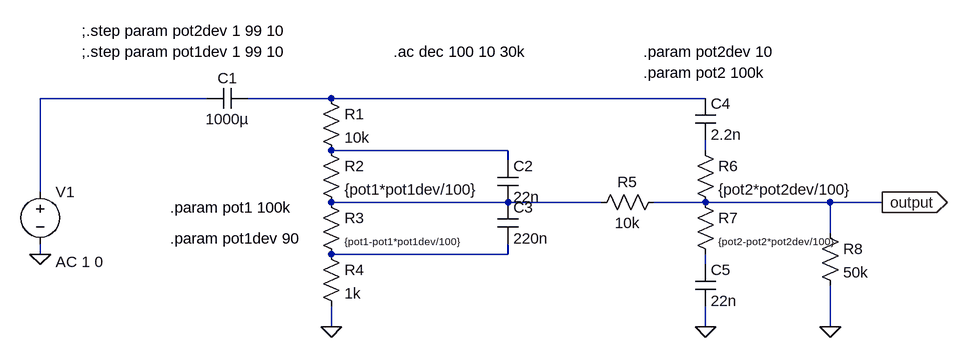
[diagram p0: schematic baxandal.asc]
baxandal.asc, the LTspice schematic file:
Version 4.1
SHEET 1 1448 680
WIRE 272 80 16 80
WIRE 464 80 336 80
WIRE 1040 80 464 80
WIRE 736 160 464 160
WIRE 1040 160 1040 144
WIRE 736 176 736 160
WIRE 16 224 16 80
WIRE 736 240 464 240
WIRE 880 240 736 240
WIRE 1040 240 960 240
WIRE 1232 240 1040 240
WIRE 1312 240 1232 240
WIRE 1232 288 1232 240
WIRE 16 320 16 304
WIRE 736 320 736 304
WIRE 736 320 464 320
WIRE 1040 336 1040 320
WIRE 464 432 464 400
WIRE 1040 432 1040 400
WIRE 1232 432 1232 368
FLAG 16 320 0
FLAG 1040 432 0
FLAG 1232 432 0
FLAG 1312 240 output
IOPIN 1312 240 Out
FLAG 464 432 0
SYMBOL voltage 16 208 R0
WINDOW 123 24 124 Left 2
WINDOW 39 0 0 Left 0
SYMATTR Value2 AC 1 0
SYMATTR InstName V1
SYMATTR Value ""
SYMBOL cap 336 64 R90
WINDOW 0 0 32 VBottom 2
WINDOW 3 32 32 VTop 2
SYMATTR InstName C1
SYMATTR Value 1000µ
SYMBOL res 448 64 R0
SYMATTR InstName R1
SYMATTR Value 10k
SYMBOL res 448 144 R0
SYMATTR InstName R2
SYMATTR Value {pot1*pot1dev/100}
SYMBOL res 448 224 R0
WINDOW 3 36 76 Left 1
SYMATTR Value {pot1-pot1*pot1dev/100}
SYMATTR InstName R3
SYMBOL res 448 304 R0
SYMATTR InstName R4
SYMATTR Value 1k
SYMBOL cap 720 176 R0
SYMATTR InstName C2
SYMATTR Value 22n
SYMBOL cap 720 240 R0
SYMATTR InstName C3
SYMATTR Value 220n
SYMBOL res 976 224 R90
WINDOW 0 0 56 VBottom 2
WINDOW 3 32 56 VTop 2
SYMATTR InstName R5
SYMATTR Value 10k
SYMBOL res 1024 144 R0
SYMATTR InstName R6
SYMATTR Value {pot2*pot2dev/100}
SYMBOL res 1024 224 R0
WINDOW 3 36 76 Left 1
SYMATTR Value {pot2-pot2*pot2dev/100}
SYMATTR InstName R7
SYMBOL cap 1024 80 R0
SYMATTR InstName C4
SYMATTR Value 2.2n
SYMBOL cap 1024 336 R0
SYMATTR InstName C5
SYMATTR Value 22n
SYMBOL res 1216 272 R0
SYMATTR InstName R8
SYMATTR Value 50k
TEXT 216 248 Left 2 !.param pot1 100k
TEXT 944 40 Left 2 !.param pot2 100k
TEXT 216 296 Left 2 !.param pot1dev 90
TEXT 944 8 Left 2 !.param pot2dev 10
TEXT 560 8 Left 2 !.ac dec 100 10 30k
TEXT 80 8 Left 2 !;.step param pot1dev 1 99 10
TEXT 80 -24 Left 2 !;.step param pot2dev 1 99 10

The netlist it stands for:
* baxandal.asc
V1 N001 0 AC 1 0
C1 N002 N001 1000µ
R1 N002 N003 10k
R2 N003 N005 {pot1*pot1dev/100}
R3 N005 N006 {pot1-pot1*pot1dev/100}
R4 N006 0 1k
C2 N003 N005 22n
C3 N005 N006 220n
R5 output N005 10k
R6 N004 output {pot2*pot2dev/100}
R7 output N007 {pot2-pot2*pot2dev/100}
C4 N002 N004 2.2n
C5 N007 0 22n
R8 output 0 50k
.param pot1 100k
.param pot2 100k
.param pot1dev 90
.param pot2dev 10
.ac dec 100 10 30k
;.step param pot1dev 1 99 10
;.step param pot2dev 1 99 10
.backanno
.end